# Altium project DHA-3v15.PrjPcb (part 3 of 3)

## Sheet DO.SchDoc
size A4 portrait; SheetNumber: 10; SheetTotal: 15
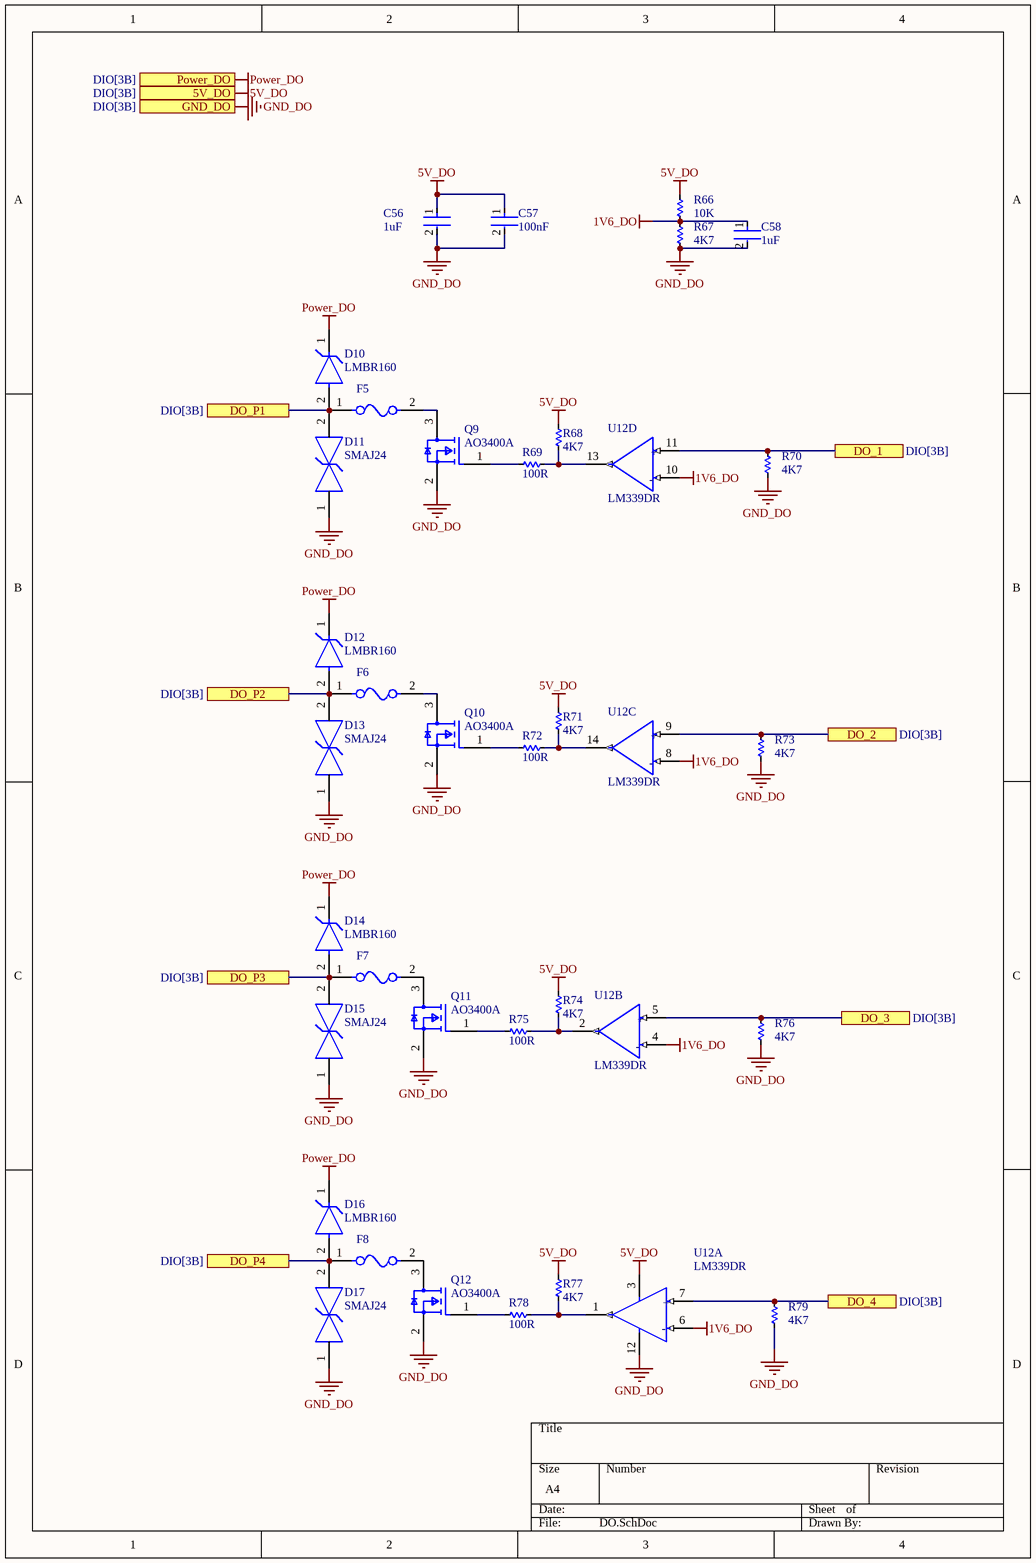
[diagram p16: DO.SchDoc]

### Parts
C56  1uF  [FP-GRM18-0_15-MFG]
C57  100nF  [FP-GRM18-0_15-MFG]
C58  1uF  [FP-GRM18-0_15-MFG]
D10  LMBR160  [FP-SOD123-MFG]
D11  SMAJ24  [FP-SMAJ-MFG]
D12  LMBR160  [FP-SOD123-MFG]
D13  SMAJ24  [FP-SMAJ-MFG]
D14  LMBR160  [FP-SOD123-MFG]
D15  SMAJ24  [FP-SMAJ-MFG]
D16  LMBR160  [FP-SOD123-MFG]
D17  SMAJ24  [FP-SMAJ-MFG]
F5  2A 30V  [FP-0468-MFG]  (value not drawn)
F6  2A 30V  [FP-0468-MFG]  (value not drawn)
F7  2A 30V  [FP-0468-MFG]  (value not drawn)
F8  2A 30V  [FP-0468-MFG]  (value not drawn)
Q9  AO3400A  [FP-SOT23-MFG]
Q10  AO3400A  [FP-SOT23-MFG]
Q11  AO3400A  [FP-SOT23-MFG]
Q12  AO3400A  [FP-SOT23-MFG]
R66  10K  [RES-SMD-0603]
R67  4K7  [RES-SMD-0603]
R68  4K7  [RES-SMD-0603]
R69  100R  [RES-SMD-0603]
R70  4K7  [RES-SMD-0603]
R71  4K7  [RES-SMD-0603]
R72  100R  [RES-SMD-0603]
R73  4K7  [RES-SMD-0603]
R74  4K7  [RES-SMD-0603]
R75  100R  [RES-SMD-0603]
R76  4K7  [RES-SMD-0603]
R77  4K7  [RES-SMD-0603]
R78  100R  [RES-SMD-0603]
R79  4K7  [RES-SMD-0603]
U12  LM339DR  [FP-D0014A-IPC_A]  (parts A,B,C,D of 4)

### Ports
5V_DO (see DIO[3B]), DO_1 (see DIO[3B]), DO_2 (see DIO[3B]), DO_3 (see DIO[3B]), DO_4 (see DIO[3B]), DO_P1 (see DIO[3B]), DO_P2 (see DIO[3B]), DO_P3 (see DIO[3B]), DO_P4 (see DIO[3B]), GND_DO (see DIO[3B]), Power_DO (see DIO[3B])

### Nets
1V6_DO: C58.1 R66.2 R67.1 U12.4(2IN-) U12.6(1IN-) U12.8(3IN-) U12.10(4IN-)
5V_DO: C56.1 C57.1 R66.1 R68.2 R71.2 R74.2 R77.2 U12.3(VCC) ; port 5V_DO  [project net 5V]
GND_DO: C56.2 C57.2 C58.2 D11.1 D13.1 D15.1 D17.1 Q9.2(S) Q10.2(S) Q11.2(S) Q12.2(S) R67.2 R70.2 R73.2 R76.2 R79.2 U12.12(GND) ; port GND_DO  [project net GND]
Power_DO: D10.1(C) D12.1(C) D14.1(C) D16.1(C) ; port Power_DO  [project net Power+]
NetD10_2: D10.2(A) D11.2 F5.1 ; port DO_P1
NetD12_2: D12.2(A) D13.2 F6.1 ; port DO_P2
NetD14_2: D14.2(A) D15.2 F7.1 ; port DO_P3
NetD16_2: D16.2(A) D17.2 F8.1 ; port DO_P4
NetF5_2: F5.2 Q9.3(D)
NetF6_2: F6.2 Q10.3(D)
NetF7_2: F7.2 Q11.3(D)
NetF8_2: F8.2 Q12.3(D)
NetQ9_1: Q9.1(G) R69.1
NetQ10_1: Q10.1(G) R72.1
NetQ11_1: Q11.1(G) R75.1
NetQ12_1: Q12.1(G) R78.1
NetR68_1: R68.1 R69.2 U12.13(OUT4)
NetR70_1: R70.1 U12.11(4IN+) ; port DO_1
NetR71_1: R71.1 R72.2 U12.14(OUT3)
NetR73_1: R73.1 U12.9(3IN+) ; port DO_2
NetR74_1: R74.1 R75.2 U12.2(2OUT)
NetR76_1: R76.1 U12.5(2IN+) ; port DO_3
NetR77_1: R77.1 R78.2 U12.1(1OUT)
NetR79_1: R79.1 U12.7(1IN+) ; port DO_4

### Notes on the sheet
- (in symbol CMP-04896-000028-1, part A) +; -
- (in symbol CMP-04896-000028-1, part B) +; -
- (in symbol CMP-04896-000028-1, part C) +; -
- (in symbol CMP-04896-000028-1, part D) +; -

### Library data of the parts
C56 = CMP-2000-05448-2: CAP CER 1UF 10V X5R 0603; Manufacturer Part Number: GRM188R61A106KE69D; Manufacturer: Murata; Temperature Coefficient: 15%; Value: 10uF; Material: Ceramic; Tolerance: 10%; Device Class L1: Passive Components; ComponentLink2Description: Datasheet; Height: 0.95mm; Package: GRM18-0.15; Octopart: https://octopart.com/grm188r61a106ke69d-murata-22851381; Digikey Description: CAP CER 10UF 10V X5R 0603; Temperature Range High: +85°C; Temperature Range Low: -55°C; Temperature Characteristic: X5R; Capacitance: 10uF; RoHS: TRUE; Device Class L2: Capacitors; ComponentLink2URL: https://search.murata.co.jp/Ceramy/image/img/A01X/G101/ENG/GRM188R61A106KE69-01A.pdf; Device Class L3: Ceramic Capacitors; Lead Free: Yes; Mouser Description: Multilayer Ceramic Capacitors MLCC - SMD/SMT 0603 10uF 10volts X5R + - 10%; Category: Cap; Voltage Rating: 10V; Temperature: -55°C to +85°C; Automotive: No
C57 = CMP-2000-05448-2: CAP CER 100nF 10V X5R 0603; Manufacturer Part Number: GRM188R61A106KE69D; Manufacturer: Murata; Temperature Coefficient: 15%; Value: 10uF; Material: Ceramic; Tolerance: 10%; Device Class L1: Passive Components; ComponentLink2Description: Datasheet; Height: 0.95mm; Package: GRM18-0.15; Octopart: https://octopart.com/grm188r61a106ke69d-murata-22851381; Digikey Description: CAP CER 10UF 10V X5R 0603; Temperature Range High: +85°C; Temperature Range Low: -55°C; Temperature Characteristic: X5R; Capacitance: 10uF; RoHS: TRUE; Device Class L2: Capacitors; ComponentLink2URL: https://search.murata.co.jp/Ceramy/image/img/A01X/G101/ENG/GRM188R61A106KE69-01A.pdf; Device Class L3: Ceramic Capacitors; Lead Free: Yes; Mouser Description: Multilayer Ceramic Capacitors MLCC - SMD/SMT 0603 10uF 10volts X5R + - 10%; Category: Cap; Voltage Rating: 10V; Temperature: -55°C to +85°C; Automotive: No
C58 = CMP-2000-05448-2: CAP CER 1uF 10V X5R 0603; Manufacturer Part Number: GRM188R61A106KE69D; Manufacturer: Murata; Temperature Coefficient: 15%; Value: 10uF; Material: Ceramic; Tolerance: 10%; Device Class L1: Passive Components; ComponentLink2Description: Datasheet; Height: 0.95mm; Package: GRM18-0.15; Octopart: https://octopart.com/grm188r61a106ke69d-murata-22851381; Digikey Description: CAP CER 10UF 10V X5R 0603; Temperature Range High: +85°C; Temperature Range Low: -55°C; Temperature Characteristic: X5R; Capacitance: 10uF; RoHS: TRUE; Device Class L2: Capacitors; ComponentLink2URL: https://search.murata.co.jp/Ceramy/image/img/A01X/G101/ENG/GRM188R61A106KE69-01A.pdf; Device Class L3: Ceramic Capacitors; Lead Free: Yes; Mouser Description: Multilayer Ceramic Capacitors MLCC - SMD/SMT 0603 10uF 10volts X5R + - 10%; Category: Cap; Voltage Rating: 10V; Temperature: -55°C to +85°C; Automotive: No
D10 D12 D14 D16 = CMP-00461-00326579-1: LMBR160 SOD123 Diode Schottky 1A 60V; NexarPartId: 326579; ESD Protection: No; Power Rating: 500mW; Forward Voltage: 900mV; Voltage Rating (DC): 20V; Impedance: 55Ω; Tolerance: 6%; Test Current: 5mA; Element Configuration: Single; Output Current: 50mA; Max Reverse Leakage Current: 100nA; Height: 1.35mm; Mount: Surface Mount; RoHS: Compliant; Contact Plating: Tin; Radiation Hardening: No; REACH SVHC: No SVHC; Max Power Dissipation: 500mW; Lead Free: Lead Free; Min Operating Temperature: -65°C; Max Operating Temperature: 150°C; Packaging: Cut Tape; Length: 2.85mm; Power Dissipation: 500mW; Schedule B: 8541100050, 8541100050; Zener Voltage: 20V; Zener Current: 5mA; Weight: 10.007382mg; Peak Reverse Current: 100nA; Width: 1.7mm; Voltage Tolerance: 6%; Termination: SMD/SMT; Working Voltage: 20V; Number of Pins: 2
D11 D13 D15 D17 = CMP-08607-000067-1: Tvs Diode 24V 38.9V SMA; Manufacturer: Littelfuse Inc; Manufacturer Part Number: SMAJ58CA; Reverse Standoff Voltage: 58V; Breakdown Voltage: 64.4V; Peak Pulse Current: 4.3A; Peak Pulse Power: 400W; Direction: Bidirectional; Clamping Voltage: 93.6V; Number Of Channels: 1; Max Junction Temp: +150°C; Device Class L2: TVS Diodes; ComponentLink2Description: Datasheet; Lead Free: Yes; Height: 2.29mm; Automotive: No; Package: SMAJ; Digikey Description: TVS DIODE 58V 93.6V DO214AC; Temperature Range Low: -65°C; Device Class L1: Circuit Protection; Temperature Range High: +150°C; Mouser Description: In a Pack of 25, Littelfuse SMAJ58CA, Bi-Directional TVS Diode, 400W, 2-Pin DO-214AC; Octopart: https://octopart.com/smaj58ca-littelfuse-350202; ComponentLink2URL: https://www.littelfuse.com/~/media/electronics/datasheets/tvs_diodes/littelfuse_tvs_diode_smaj_datasheet.pdf.pdf; Temperature: -65°C to +150°C; Device Class L3: unset; Category: Diode; RoHS: TRUE
F5-F8 = CMP-08605-000076-1: SMD1206P200TF/30 Cầu chì tự phục hồi PPTC 2A 30V SMD1206; Manufacturer Part Number: 0468.500NR; Manufacturer: Littelfuse; Fuse Voltage Drop: 156.77mV; Fuse I2T: 0.031A2Sec; Fuse Interrupt Dc Current: 50A; Fuse Current: 0.5A; Resistance: 0.27Ω; Max Fuse Dc Voltage: 63V; Fuse Blow Speed: Slow; Value: 0.27Ω; Package: 0468; Digikey Description: FUSE BOARD MOUNT 500MA 63VAC/VDC; Mouser Description: Surface Mount Fuses 63V .5A Slo-Blo; Temperature Range High: +90°C; Lead Free: Yes; Height: 0.762mm; Device Class L1: Circuit Protection; Category: Fuse; Octopart: https://octopart.com/0468.500nr-littelfuse-672821; Fuse Interrupt Ac Current: 50A; Temperature Range Low: -55°C; Automotive: No; ComponentLink2URL: https://www.littelfuse.com/~/media/electronics/datasheets/fuses/littelfuse_fuse_468_datasheet.pdf.pdf; ComponentLink2Description: Datasheet; RoHS: TRUE; Max Fuse Ac Voltage: 63V; Temperature: -55°C to +90°C; Device Class L2: Fuses; Device Class L3: unset; Voltage Rating: 63V
  F6: ComponentLink3Description: New link; ComponentLink3URL: https://linhkien.cxtvn.com/6537-cau-chi-tu-phuc-hoi-pptc-smd1206.html
Q9-Q12 = CMP-83955-000006-1: AO3400 SOT23-3 MOSFET N-1CH 5A 30V (A09T); Input Capacitance: 630pF; Number of Elements: 1; Rds On Max: 26.5mR; Max Power Dissipation: 1.4W; Continuous Drain Current (ID): 5.7A; Gate to Source Voltage (Vgs): 12V; Min Operating Temperature: -55°C; Lead Free: Lead Free; Number of Pins: 3; Drain to Source Voltage (Vdss): 30V; Case/Package: SOT-23; Mount: Surface Mount; Radiation Hardening: No; Packaging: Tape and Reel; Max Operating Temperature: 150°C; Power Dissipation: 1.4W
R66-R79 = Res-SMD: Res 0603 5%; Manufacturer: Generic Components; Class: Passive; Published: 08/06/2000; Publisher: Altium Hobart Technology Centre
U12 = CMP-04896-000028-1: IC QUAD DIFF COMP 14-SOIC; Manufacturer: Texas Instruments; Nominal Supply Current: 0.8mA; Min Dual Supply Voltage: 1V; Number Of Channels: 4; Input Offset Voltage: 2mV; Max Junction Temp: +70°C; Min Supply Voltage: 2V; Response Time: 1.3us; Max Dual Supply Voltage: 18V; Max Supply Voltage: 30V; Standoff Height: 0.1mm; Input Bias Current: -0.025uA; Output Current Per Channel: 6mA; Category: IC; Octopart: https://octopart.com/lm339dr-texas+instruments-45532; Automotive: No; Temperature: 0°C to +70°C; Ipc Land Pattern Name: SOIC127P600X175-14; Temperature Range Low: 0°C; Mouser Description: Analog Comparators Quad Differential; Lead Free: Yes; Digikey Description: IC QUAD DIFF COMP 14-SOIC; ComponentLink2URL: http://www.ti.com/lit/ds/symlink/lm339.pdf; Device Class L3: Comparators; Manufacturer Part Number: LM339DR; Temperature Range High: +70°C; Device Class L2: Linear ICs; Height: 1.75mm; Device Class L1: Integrated Circuits (ICs); Package: D0014A; RoHS: TRUE; ComponentLink2Description: Datasheet

## Sheet DI.SchDoc
size A4 portrait; SheetNumber: 9; SheetTotal: 14
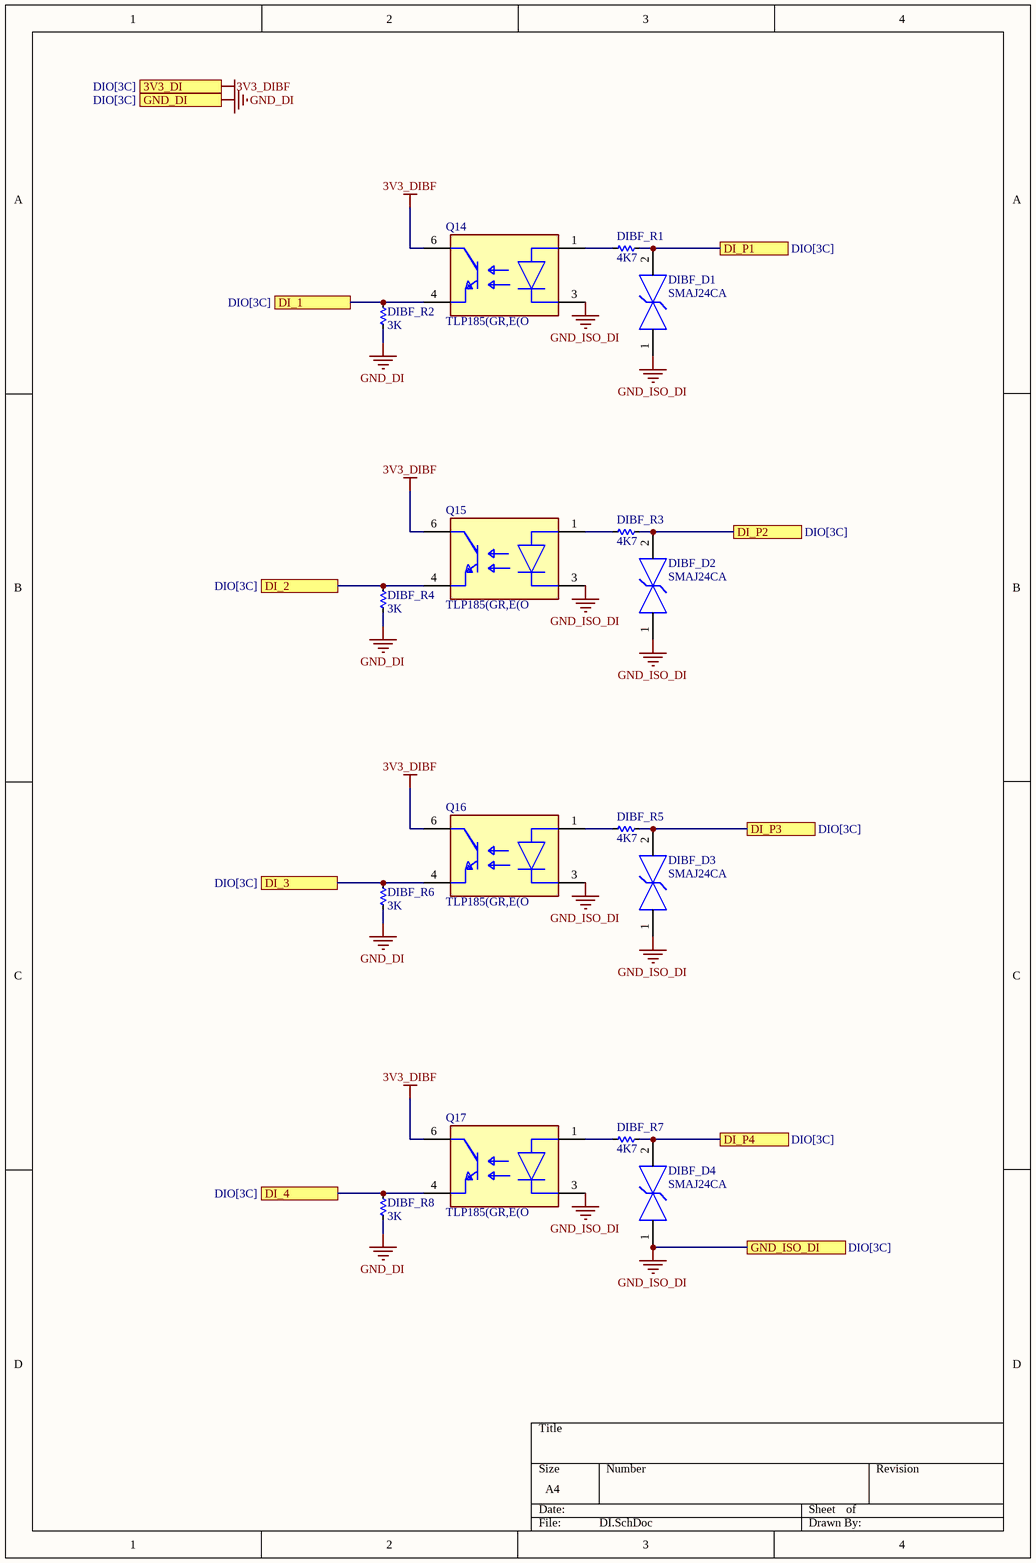
[diagram p17: DI.SchDoc]

### Parts
DIBF_D1  SMAJ24CA  [FP-SMAJ-CA-MFG]
DIBF_D2  SMAJ24CA  [FP-SMAJ-CA-MFG]
DIBF_D3  SMAJ24CA  [FP-SMAJ-CA-MFG]
DIBF_D4  SMAJ24CA  [FP-SMAJ-CA-MFG]
DIBF_R1  4K7  [RES-SMD-0805]
DIBF_R2  3K  [RES-SMD-0805]
DIBF_R3  4K7  [RES-SMD-0805]
DIBF_R4  3K  [RES-SMD-0805]
DIBF_R5  4K7  [RES-SMD-0805]
DIBF_R6  3K  [RES-SMD-0805]
DIBF_R7  4K7  [RES-SMD-0805]
DIBF_R8  3K  [RES-SMD-0805]
Q14  TLP185(GR,E(O  [FP-11-4M1S-MFG]
Q15  TLP185(GR,E(O  [FP-11-4M1S-MFG]
Q16  TLP185(GR,E(O  [FP-11-4M1S-MFG]
Q17  TLP185(GR,E(O  [FP-11-4M1S-MFG]

### Ports
3V3_DI (see DIO[3C]), DI_1 (see DIO[3C]), DI_2 (see DIO[3C]), DI_3 (see DIO[3C]), DI_4 (see DIO[3C]), DI_P1 (see DIO[3C]), DI_P2 (see DIO[3C]), DI_P3 (see DIO[3C]), DI_P4 (see DIO[3C]), GND_DI (see DIO[3C]), GND_ISO_DI (see DIO[3C])

### Nets
3V3_DIBF: Q14.6(C) Q15.6(C) Q16.6(C) Q17.6(C) ; port 3V3_DI  [project net 3V3]
GND_DI: DIBF_R2.2 DIBF_R4.2 DIBF_R6.2 DIBF_R8.2 ; port GND_DI  [project net GND]
GND_ISO_DI: DIBF_D1.1 DIBF_D2.1 DIBF_D3.1 DIBF_D4.1 Q14.3(C) Q15.3(C) Q16.3(C) Q17.3(C) ; port GND_ISO_DI
NetDIBF_D1_2: DIBF_D1.2 DIBF_R1.1 ; port DI_P1
NetDIBF_D2_2: DIBF_D2.2 DIBF_R3.1 ; port DI_P2
NetDIBF_D3_2: DIBF_D3.2 DIBF_R5.1 ; port DI_P3
NetDIBF_D4_2: DIBF_D4.2 DIBF_R7.1 ; port DI_P4
NetDIBF_R1_2: DIBF_R1.2 Q14.1(A)
NetDIBF_R2_1: DIBF_R2.1 Q14.4(E) ; port DI_1
NetDIBF_R3_2: DIBF_R3.2 Q15.1(A)
NetDIBF_R4_1: DIBF_R4.1 Q15.4(E) ; port DI_2
NetDIBF_R5_2: DIBF_R5.2 Q16.1(A)
NetDIBF_R6_1: DIBF_R6.1 Q16.4(E) ; port DI_3
NetDIBF_R7_2: DIBF_R7.2 Q17.1(A)
NetDIBF_R8_1: DIBF_R8.1 Q17.4(E) ; port DI_4

### Library data of the parts
DIBF_D1-DIBF_D4 = CMP-2000-07087-2: TVS DIODE 24V 38.9V DO214AC; Manufacturer: Littelfuse; Peak Pulse Power: 400W; Direction: Bidirectional; Breakdown Voltage: 26.7V; Max Junction Temp: +150°C; Number Of Channels: 1; Peak Pulse Current: 10.3A; Digikey Description: TVS DIODE 24V 38.9V DO214AC; Temperature Range Low: -65°C; Temperature: -65°C to +150°C; Manufacturer Part Number: SMAJ24CA; Octopart: https://octopart.com/smaj24ca-littelfuse-350011; Height: 2.29mm; Clamping Voltage: 38.9V; Device Class L1: Circuit Protection; Automotive: No; Device Class L2: TVS Diodes; Package: SMAJ-CA; ComponentLink2URL: https://www.littelfuse.com/~/media/electronics/datasheets/tvs_diodes/littelfuse_tvs_diode_smaj_datasheet.pdf.pdf; RoHS: TRUE; Temperature Range High: +150°C; Category: Diode; Lead Free: Yes; Reverse Standoff Voltage: 24V; Device Class L3: unset; ComponentLink2Description: Datasheet; Mouser Description: In a Pack of 25, Littelfuse SMAJ24CA, Bi-Directional TVS Diode, 400W, 2-Pin DO-214AC
DIBF_R1-DIBF_R8 = Res-SMD: Res 0805 1%; Manufacturer: Generic Components; Class: Passive; Published: 08/06/2000; Publisher: Altium Hobart Technology Centre
Q14-Q17 = CMP-35887-000005-1: OPTOISO 3.75KV TRANS 6-SO 4 LEAD; Manufacturer: Toshiba; Emiiter Collector Voltage: 7V; Isolation Voltage: 3750Vrms; Collector Emitter Voltage: 80V; Max Junction Temp: +125°C; Turn On Delay Time: 9us; Standoff Height: 0.1mm; Power Dissipation: 200mW; Forward Current: 10mA; Min Current Transfer Ratio: 100%; Forward Voltage: 1.25V; Reverse Voltage: 5V; Max Current Transfer Ratio: 400%; Manufacturer Part Number: TLP185(GR,E(O; Device Class L1: Optoelectronics; ComponentLink2Description: Datasheet; Lead Free: Yes; Height: 2.2mm; Octopart: https://octopart.com/tlp185%28gr%2Ce%28o-toshiba-23809180; RoHS: TRUE; Temperature: -55°C to +110°C; Category: Trans; Temperature Range Low: -55°C; Automotive: No; Package: 11-4M1S; Device Class L2: Optocouplers; Footprint Url: https://toshiba.semicon-storage.com/eu/design-support/package/detail.4pin%20SO6.html; Digikey Description: OPTOISO 3.75KV TRANS 6-SO 4 LEAD; Ipc Land Pattern Name: SOIC254P700X220-4; Temperature Range High: +110°C; Turn Off Delay Time: 9us; ComponentLink2URL: https://toshiba.semicon-storage.com/info/docget.jsp?did=11791&prodName=TLP185; Device Class L3: unset

## Sheet RT.SchDoc
size A; SheetNumber: 15; SheetTotal: 15
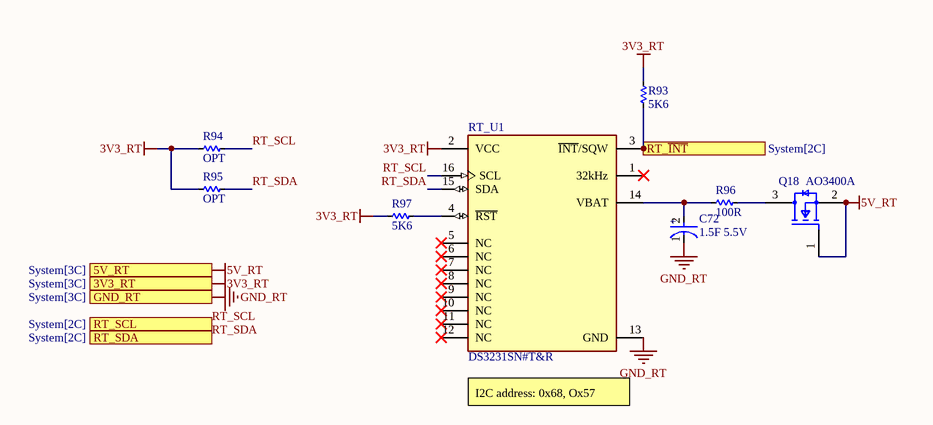
[diagram p18: RT.SchDoc]

### Parts
C72  1.5F 5.5V  [FP-FT0H474ZF-MFG]
Q18  AO3400A  [FP-SOT23-IPC_A]
R93  5K6  [RES-SMD-0603]
R94  OPT  [RES-SMD-0603]
R95  OPT  [RES-SMD-0603]
R96  100R  [RES-SMD-0805]
R97  5K6  [RES-SMD-0603]
RT_U1  DS3231SN#T&R  [FP-W16-H2-MFG]

### Ports
3V3_RT (see System[3C]), 5V_RT (see System[3C]), GND_RT (see System[3C]), RT_SCL (see System[2C]), RT_SDA (see System[2C]), RT_~{INT} (see System[2C])

### Nets
3V3_RT: R93.2 R94.2 R95.2 R97.2 RT_U1.2(VCC) ; port 3V3_RT  [project net 3V3]
5V_RT: Q18.1(G) Q18.2(S) ; port 5V_RT  [project net 5V]
GND_RT: C72.1(C) RT_U1.13(GND) ; port GND_RT  [project net GND]
RT_SCL: R94.1 RT_U1.16(SCL) ; port RT_SCL  [project net AI_SCL_3V3]
RT_SDA: R95.1 RT_U1.15(SDA) ; port RT_SDA  [project net AI_SDA_3V3]
NetC72_2: C72.2(A) R96.1 RT_U1.14(VBAT)
NetQ18_3: Q18.3(D) R96.2
NetR93_1: R93.1 RT_U1.3(~{INT}/SQW) ; port RT_~{INT}
NetR97_1: R97.1 RT_U1.4(~{RST})

Not connected (* = marked no-connect by the designer): RT_U1 1(32kHz)* 5(NC)* 6(NC)* 7(NC)* 8(NC)* 9(NC)* 10(NC)* 11(NC)* 12(NC)*

### Notes on the sheet
- (near RT_U1) I2C address: 0x68, Ox57
- (in symbol CMP-03024-000001-1) +

### Library data of the parts
C72 = CMP-03024-000001-1: Siêu tụ 1.5F 5.5V chân nằm SE-5R5-D155VYC3H; Manufacturer: KEMET; Manufacturer Part Number: FT0H474ZF; Capacitance: 0.47F; Tolerance: -20/+80%; Value: 0.47F; Octopart: https://octopart.com/ft0h474zf-kemet-30531665; Automotive: No; Device Class L3: Supercapacitors; Digikey Description: CAP 470MF -20% +80% 5.5V T/H; ComponentLink2Description: Datasheet; ComponentLink2URL: https://content.kemet.com/datasheets/KEM_S6014_FT.pdf; Device Class L1: Passive Components; Height: 13mm; Category: Cap; RoHS: TRUE; Lead Free: Yes; Temperature Range Low: -40°C; Temperature: -40°C to +85°C; Voltage Rating: 5.5V; Device Class L2: Capacitors; Package: FT0H474ZF; Mouser Description: Supercapacitors / Ultracapacitors 0.47F 5.5volts Radial Super Cap; Temperature Range High: +85°C
Q18 = CMP-83955-000006-1: OPT; Input Capacitance: 630pF; Drain to Source Voltage (Vdss): 30V; Number of Elements: 1; Rds On Max: 26.5mR; Max Power Dissipation: 1.4W; Continuous Drain Current (ID): 5.7A; Gate to Source Voltage (Vgs): 12V; Min Operating Temperature: -55°C; Lead Free: Lead Free; Number of Pins: 3; Case/Package: SOT-23; Mount: Surface Mount; Radiation Hardening: No; Packaging: Tape and Reel; Max Operating Temperature: 150°C; Power Dissipation: 1.4W
R93-R95 R97 = Res-SMD: Resistor 0603; Manufacturer: Generic Components; Class: Passive; Published: 08/06/2000; Publisher: Altium Hobart Technology Centre
R96 = Res-SMD: Res 0805; Manufacturer: Generic Components; Class: Passive; Published: 08/06/2000; Publisher: Altium Hobart Technology Centre
RT_U1 = CMP-0254-00375-2: IC RTC CLK/CALENDAR I2C 16-SOIC; Operating Supply Voltage: 3.3V; Max Supply Voltage: 5.5V; Logic Function: Clock; Time Format: HH:MM:SS; Date Format: YY-MM-DD-dd; Min Supply Voltage: 2.3V; Min Operating Temperature: -40°C; Packaging: Tape and Reel; Radiation Hardening: No; Package Quantity: 1000; Case/Package: SOIC; Max Operating Temperature: 85°C; Lead Free: Lead Free; Interface: I2C; Contact Plating: Tin; Number of Pins: 16; Mount: Surface Mount

## Nets that join several sheets
3V3: U_MB1 (R19_U_MB1.2), uSD (8 pins), AI (Q2.1 Q3.1 R5.1 R7.1), PW (C51.1 C52.1 U9.2 U9.4), SIM (R42.1 R50.1), U_MB2 (R19_U_MB2.2), LED (12 pins), DIO (R92.2 U15.18), DI (Q14.6 Q15.6 Q16.6 Q17.6), RT (5 pins)
5V: U_MB1 (5 pins), LR (C17.1 U4.3), ESP32 (C62.1 U13.3), AI (C6.1 R6.1 R8.1 U3.8), PW (R52.1), SIM (C25.1 C26.1 R32.2 U7.2), U_MB2 (5 pins), LCD (7 pins), DO (8 pins), RT (Q18.1 Q18.2)
8V: AI (C2.1 U2.4), PW (C54.1 U10.3)
GND: System (J1.5 P2.5), U_MB1 (7 pins), LR (14 pins), uSD (13 pins), ESP32 (22 pins), AI (21 pins), PW (22 pins), SIM (63 pins), U_MB2 (7 pins), LCD (7 pins), LED (C55.2 R57.2 U11.8 U11.13), DIO (U15.3 U15.4 U15.5 U15.9), DO (17 pins), DI (DIBF_R2.2 DIBF_R4.2 DIBF_R6.2 DIBF_R8.2), RT (C72.1 RT_U1.13)
GND_ISO_DI: System (P2.10), DI (8 pins)
Power+: System (P1.1), IP (D20.2 Q13.4), DO (D10.1 D12.1 D14.1 D16.1)
AI_P1: System (J1.1), AI (F1.2)
AI_P2: System (J1.2), AI (F2.2)
AI_P3: System (J1.3), AI (F3.2)
AI_P4: System (J1.4), AI (F4.2)
AI_SCL_3V3: ESP32 (U14.26), AI (Q2.2 R5.2), DIO (U15.1), RT (R94.1 RT_U1.16)
AI_SCL_5V: AI (Q2.3 R6.2 U3.10), LCD (U1.14)
AI_SDA_3V3: ESP32 (U14.25), AI (Q3.2 R7.2), DIO (U15.2), RT (R95.1 RT_U1.15)
AI_SDA_5V: AI (Q3.3 R8.2 U3.9), LCD (U1.15)
Earth1: System (P4.3), U_MB2 (MB_C1_U_MB2.2 MB_F1_U_MB2.2 MB_F2_U_MB2.2 MB_R5_U_MB2.2)
Earth1: System (P3.3), U_MB1 (MB_C1_U_MB1.2 MB_F1_U_MB1.2 MB_F2_U_MB1.2 MB_R5_U_MB1.2)
LR_BUSY: LR (R26.1 U5.7), ESP32 (U14.9)
LR_MISO: LR (R22.1 U5.3), ESP32 (U14.32)
LR_MOSI: LR (R23.1 U5.4), ESP32 (U14.33)
LR_NSS: LR (R25.1 U5.6), ESP32 (U14.8)
LR_~{RESET}: LR (R27.1 U5.21), ESP32 (U14.6)
LR_SCK: LR (R24.1 U5.5), ESP32 (U14.7)
MB_A1+: System (P4.2), U_MB2 (MB_F1_U_MB2.1 MB_R2_U_MB2.1)
MB_A1+: System (P3.2), U_MB1 (MB_F1_U_MB1.1 MB_R2_U_MB1.1)
MB_B1-: System (P4.1), U_MB2 (MB_F2_U_MB2.1 MB_R3_U_MB2.1)
MB_B1-: System (P3.1), U_MB1 (MB_F2_U_MB1.1 MB_R3_U_MB1.1)
NetC59_1: PW (FL1.1 J5.1), IP (7 pins)
NetD10_2: System (P2.1), DO (D10.2 D11.2 F5.1)
NetD12_2: System (P2.2), DO (D12.2 D13.2 F6.1)
NetD14_2: System (P2.3), DO (D14.2 D15.2 F7.1)
NetD16_2: System (P2.4), DO (D16.2 D17.2 F8.1)
NetD20_1: System (P1.2), PW (FL1.3 J5.2), IP (D20.1 D21.1 R81.2 R82.2)
NetDIBF_D1_2: System (P2.6), DI (DIBF_D1.2 DIBF_R1.1)
NetDIBF_D2_2: System (P2.7), DI (DIBF_D2.2 DIBF_R3.1)
NetDIBF_D3_2: System (P2.8), DI (DIBF_D3.2 DIBF_R5.1)
NetDIBF_D4_2: System (P2.9), DI (DIBF_D4.2 DIBF_R7.1)
NetDIBF_R2_1: DIO (U15.13), DI (DIBF_R2.1 Q14.4)
NetDIBF_R4_1: DIO (U15.12), DI (DIBF_R4.1 Q15.4)
NetDIBF_R6_1: DIO (U15.11), DI (DIBF_R6.1 Q16.4)
NetDIBF_R8_1: DIO (U15.10), DI (DIBF_R8.1 Q17.4)
NetMB_U1_U_MB1_1: U_MB1 (MB_U1_U_MB1.1 R19_U_MB1.1), ESP32 (U14.10)
NetMB_U1_U_MB2_1: ESP32 (U14.4), U_MB2 (MB_U1_U_MB2.1 R19_U_MB2.1)
NetQ7_3: ESP32 (U14.36), SIM (Q7.3 R42.2)
NetQ8_3: ESP32 (U14.37), SIM (Q8.3 R50.2)
NetR17_U_MB1_2: U_MB1 (R17_U_MB1.2 R18_U_MB1.2), ESP32 (U14.11)
NetR17_U_MB2_2: ESP32 (U14.5), U_MB2 (R17_U_MB2.2 R18_U_MB2.2)
NetR35_2: ESP32 (U14.39), SIM (R35.2)
NetR36_2: ESP32 (U14.38), SIM (R36.2)
NetR39_2: ESP32 (U14.35), SIM (R39.2)
NetR70_1: DIO (U15.14), DO (R70.1 U12.11)
NetR73_1: DIO (U15.15), DO (R73.1 U12.9)
NetR76_1: DIO (U15.17), DO (R76.1 U12.5)
NetR79_1: DIO (U15.16), DO (R79.1 U12.7)
NetR92_1: ESP32 (U14.12), DIO (R92.1 U15.6)
NetR93_1: ESP32 (U14.31), RT (R93.1 RT_U1.3)
NetU11_11: ESP32 (U14.17), LED (U11.11)
NetU11_12: ESP32 (U14.16), LED (U11.12)
NetU11_14: ESP32 (U14.15), LED (U11.14)
NetU14_24: ESP32 (U14.24), DIO (U15.8)
SD_CLK: uSD (D27.2 J6.5), ESP32 (U14.20)
SD_CMD: uSD (D26.2 J6.3 R85.1), ESP32 (U14.21)
SD_D0: uSD (D22.2 J6.7 R86.1), ESP32 (U14.19)
SD_D1: uSD (D23.2 J6.8 R87.1), ESP32 (U14.18)
SD_D2: uSD (D24.2 J6.1 R83.1), ESP32 (U14.23)
SD_D3: uSD (D25.2 J6.2 R84.1), ESP32 (U14.22)